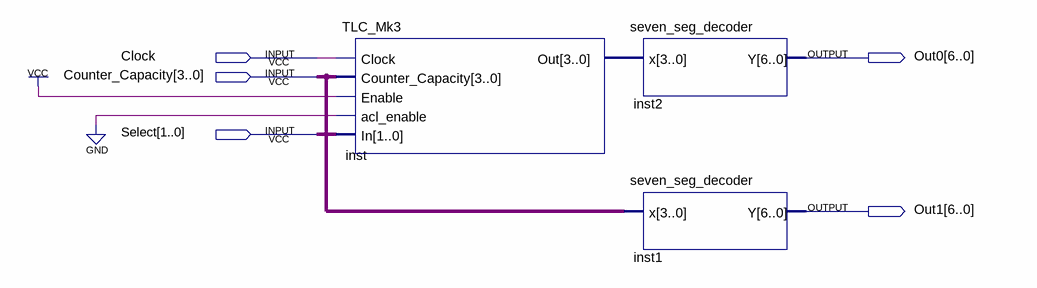
[diagram p0: schematic sheet]
// Quartus schematic TLC_Mk3_Test.bdf as structural Verilog: 3 symbols, 5 pins
module TLC_Mk3_Test (
  input  Clock,
  input  [3:0] Counter_Capacity,
  input  [1:0] Select,
  output [6:0] Out0,
  output [6:0] Out1
);

  wire [3:0] inst_out;

  TLC_Mk3 inst (
    .Clock(Clock), .Counter_Capacity(Counter_Capacity), .Enable(1'b1), .acl_enable(1'b0), .In(Select),
    .Out(inst_out));
  seven_seg_decoder inst2 (.x(inst_out), .Y(Out0));
  seven_seg_decoder inst1 (.x(Counter_Capacity), .Y(Out1));
endmodule
